# EAGLE design HRF_Board (EAGLE 9.5.2)
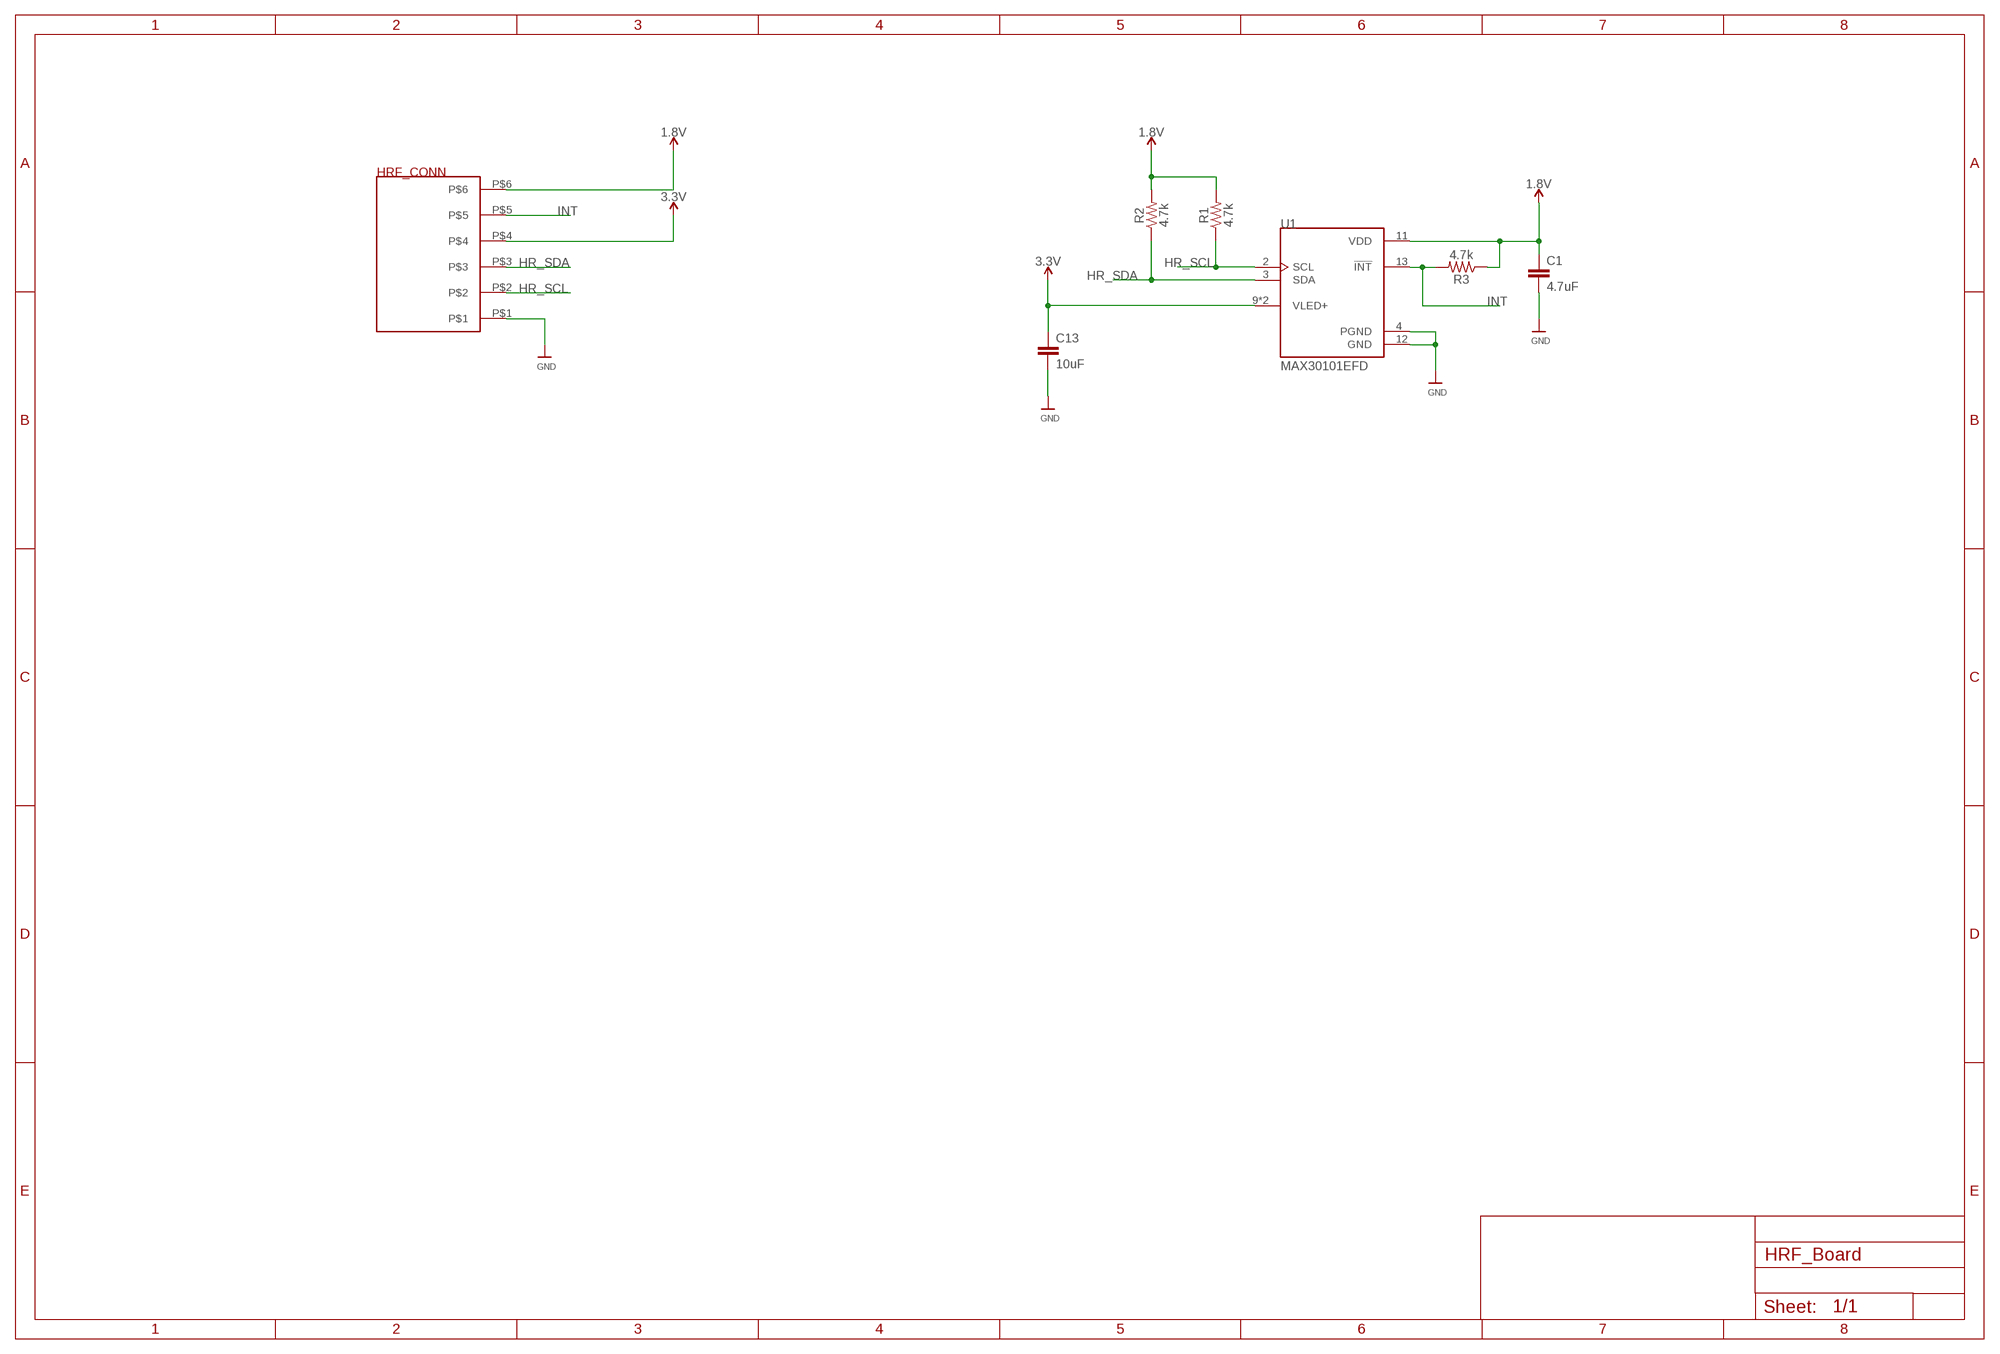
[diagram p0: schematic, sheet 1]

## Parts
C1  4.7uF  1.0UF-0603-16V-10%  [0603]
C13  10uF  1.0UF-0603-16V-10%  [0603]
R1  4.7k  100KOHM-0603-1/10W-1%  [0603]
R2  4.7k  100KOHM-0603-1/10W-1%  [0603]
R3  4.7k  100KOHM-0603-1/10W-1%  [0603]
U1  MAX30101EFD  [PSON80P560X330X165-14N]
U$1  HRF_CONN  [HRF_CONN]

## Nets
1.8V: C1.1 R1.2 R2.2 R3.1 U1.11(VDD) U$1.P$6
3.3V: C13.1 U1.9(VLED+) U1.10(VLED+) U$1.P$4
GND: C1.2 C13.2 U1.4(PGND) U1.12(GND) U$1.P$1
HR_SCL: R1.1 U1.2(SCL) U$1.P$2
HR_SDA: R2.1 U1.3(SDA) U$1.P$3
INT: R3.2 U1.13(!INT) U$1.P$5

## Library data of the parts
C1 C13 = SparkFun-Capacitors:1.0UF: 1µF ceramic capacitors A capacitor is a passive two-terminal electrical component used to store electrical energy temporarily in an electric field.; PROD_ID: CAP-00868; VALUE: 1.0uF
R1-R3 = SparkFun-Resistors:100KOHM: 100kΩ resistor A resistor is a passive two-terminal electrical component that implements electrical resistance as a circuit element. Resistors act to reduce current flow, and, at the same time, act to lower voltage levels within circuits. - Wikipedia; PROD_ID: RES-07828; VALUE: 100k
U1 = MAX30101EFD:MAX30101EFD: MAX30101 High-Sensitivity Pulse Oximeter and Heart-Rate Sensor The MAX30101 is an integrated pulse oximetry and heart-rate monitor module. It includes internal LEDs, photodetectors, optical elements, and low-noise electronics with ambient light rejection. The MAX30101 provides a complete system solution to ease the design-in process for mobile and wearable devices. The MAX30101 operates on a single 1.8V power supply and a separate 5.0V power supply for the internal LEDs. Communication is through a standard I2C-compatible interface. The module can be shut down through software with zero standby current, allowing the power rails to remain powered at all times; DESCRIPTION: Oximeter/Heart Rate Sensor I²C Output; DIGI-KEY_PART_NUMBER: MAX30101EFD+-ND; DIGI-KEY_PURCHASE_URL: https://www.digikey.com/product-detail/en/maxim-integrated/MAX30101EFD-/MAX30101EFD--ND/6123035?utm_source=snapeda&utm_medium=aggregator&utm_campaign=symbol; MF: Maxim Integrated; MP: MAX30101EFD+; PACKAGE: OLGA-14 Maxim
U$1 = HRF_CONN:HRF_CONN

## Board
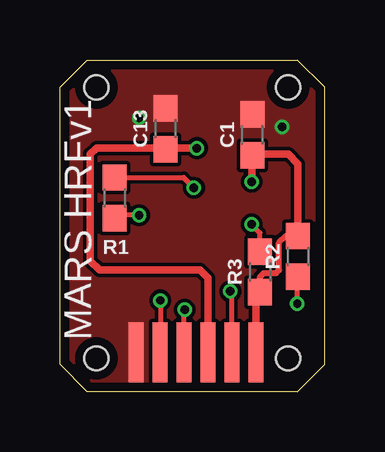
[diagram p1: board, top side]
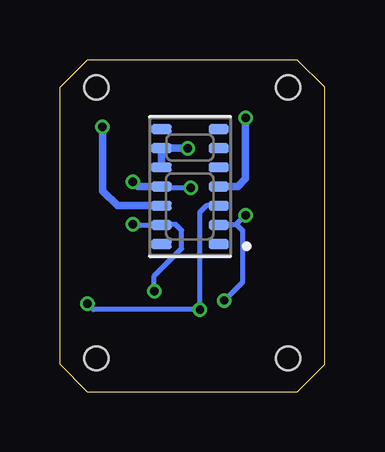
[diagram p2: board, bottom side, seen from below]

Size 11.05 x 13.84 mm. Coordinates in mm from the lower left corner, seen from the top.
Outline: 9.91,0 1.14,0 0,1.14 0,12.7 1.14,13.84 9.91,13.84 11.05,12.7 11.05,1.14 9.91,0
Copper layers (1*16): Top 0.035559375mm / dielectric 1.6mm / Bottom 0.035559375mm
Design rules "OSH *": minimum track width 6mil, minimum drill 10mil, track to track 6mil, track to pad 6mil, pad to pad 6mil, via to via 6mil, smd to smd 6mil, copper to edge 15mil, drill to drill 6mil, minimum pad ring 5mil, minimum via ring 5mil, stop-mask expansion 2.5mil, vias tented up to drill 30mil, thermal gap 10mil
Holes 1 mm at 9.53,12.7 9.53,1.4 1.52,1.4 1.52,12.7

### Footprints (pad centres in the part's own frame; a part is rotated, then mirrored left to right if it is on the bottom)
0603 = smd 1.1 x 1: 1 -0.85,0; 2 0.85,0
PSON80P560X330X165-14N = smd 0.84 x 0.4: 1 -1.195,2.4; 2 -1.195,1.6; 3 -1.195,0.8; 4 -1.195,0; 5 -1.195,-0.8; 6 -1.195,-1.6; 7 -1.195,-2.4; 8 1.195,-2.4; 9 1.195,-1.6; 10 1.195,-0.8; 11 1.195,0; 12 1.195,0.8; 13 1.195,1.6; 14 1.195,2.4
HRF_CONN = smd 0.635 x 2.5: P$1 0,1; P$2 1,1; P$3 2,1; P$4 3,1; P$5 4,1; P$6 5,1

### Placement (x,y rotation side)
C1  8.03,10.72 90 top
C13  4.41,10.97 90 top
R1  2.29,8.09 90 top
R2  9.94,5.65 90 top
R3  8.35,5 90 top
U1  5.62,8.56 180 bottom
U$1  3.17,0.64 0 top

### Tracks (layer width: path | path; a pad name or v marks a point on that pad's centre or on a via)
1.8V  (via drill 0.35)
  Top 0.203: R1.2 5.16,8.94 v5.59,8.51
  Top 0.254: R3.1 8.35,4.8 8.51,4.95 9.02,4.95 9.14,5.08 9.14,6.22 9.42,6.5 R2.2
  Top 0.305: R2.2 9.94,9.49 9.53,9.91 8.07,9.91 C1.1 8,9.83 v8,8.76 | U$1.P$6 8.18,3.97 R3.1
  Bottom 0.203: v5.59,8.51 6.76,8.51 U1.11
  Bottom 0.305: U1.11 7.8,8.56 v8,8.76
3.3V  (via drill 0.35)
  Top 0.305: U$1.P$4 6.17,4.75 5.84,5.08 1.65,5.08 1.27,5.46 1.27,9.91 1.52,10.16 4.37,10.16 C13.1 4.45,10.16 v5.71,10.16
  Bottom 0.305: v5.71,10.16 U1.9 | U1.9 | U1.9 U1.10
GND  (via drill 0.35)
  Bottom 0.305: U1.4 3.63,8.56 3.3,8.89 v3.3,11.43 | U1.12 8.65,7.76 9.27,8.38 v9.27,11.05
  pour Top (no thermals): 1.14,0 0,1.14 0,12.7 1.14,13.84 9.91,13.84 11.05,12.7 11.05,1.14 9.91,0
HR_SCL  (via drill 0.35)
  Top 0.203: v4.19,3.81 4.19,1.65 U$1.P$2 | v3.3,7.37 2.42,7.37 R1.1
  Bottom 0.203: 3.66,6.96 U1.2 | 3.66,6.96 3.43,6.73 3.43,4.57 v4.19,3.81 | 3.66,6.96 3.66,7.01 v3.3,7.37
HR_SDA  (via drill 0.35)
  Top 0.203: U$1.P$3 5.17,3.4 v5.21,3.43 | v9.91,3.68 9.91,4.77 R2.1
  Bottom 0.203: U1.3 4.94,7.76 5.21,7.49 v5.21,3.43 9.65,3.43 v9.91,3.68
INT  (via drill 0.35)
  Top 0.203: U$1.P$5 7.17,4.13 v7.11,4.19 | R3.2 8.35,6.63 v8,6.99
  Bottom 0.203: v7.11,4.19 7.11,4.83 5.97,5.97 5.97,6.73 6.22,6.99 6.79,6.99 U1.13 7.98,6.96 v8,6.99

### Text on the board
tNames: MARS HRFv1